# EAGLE schematic base_station (EAGLE 6.6.0)
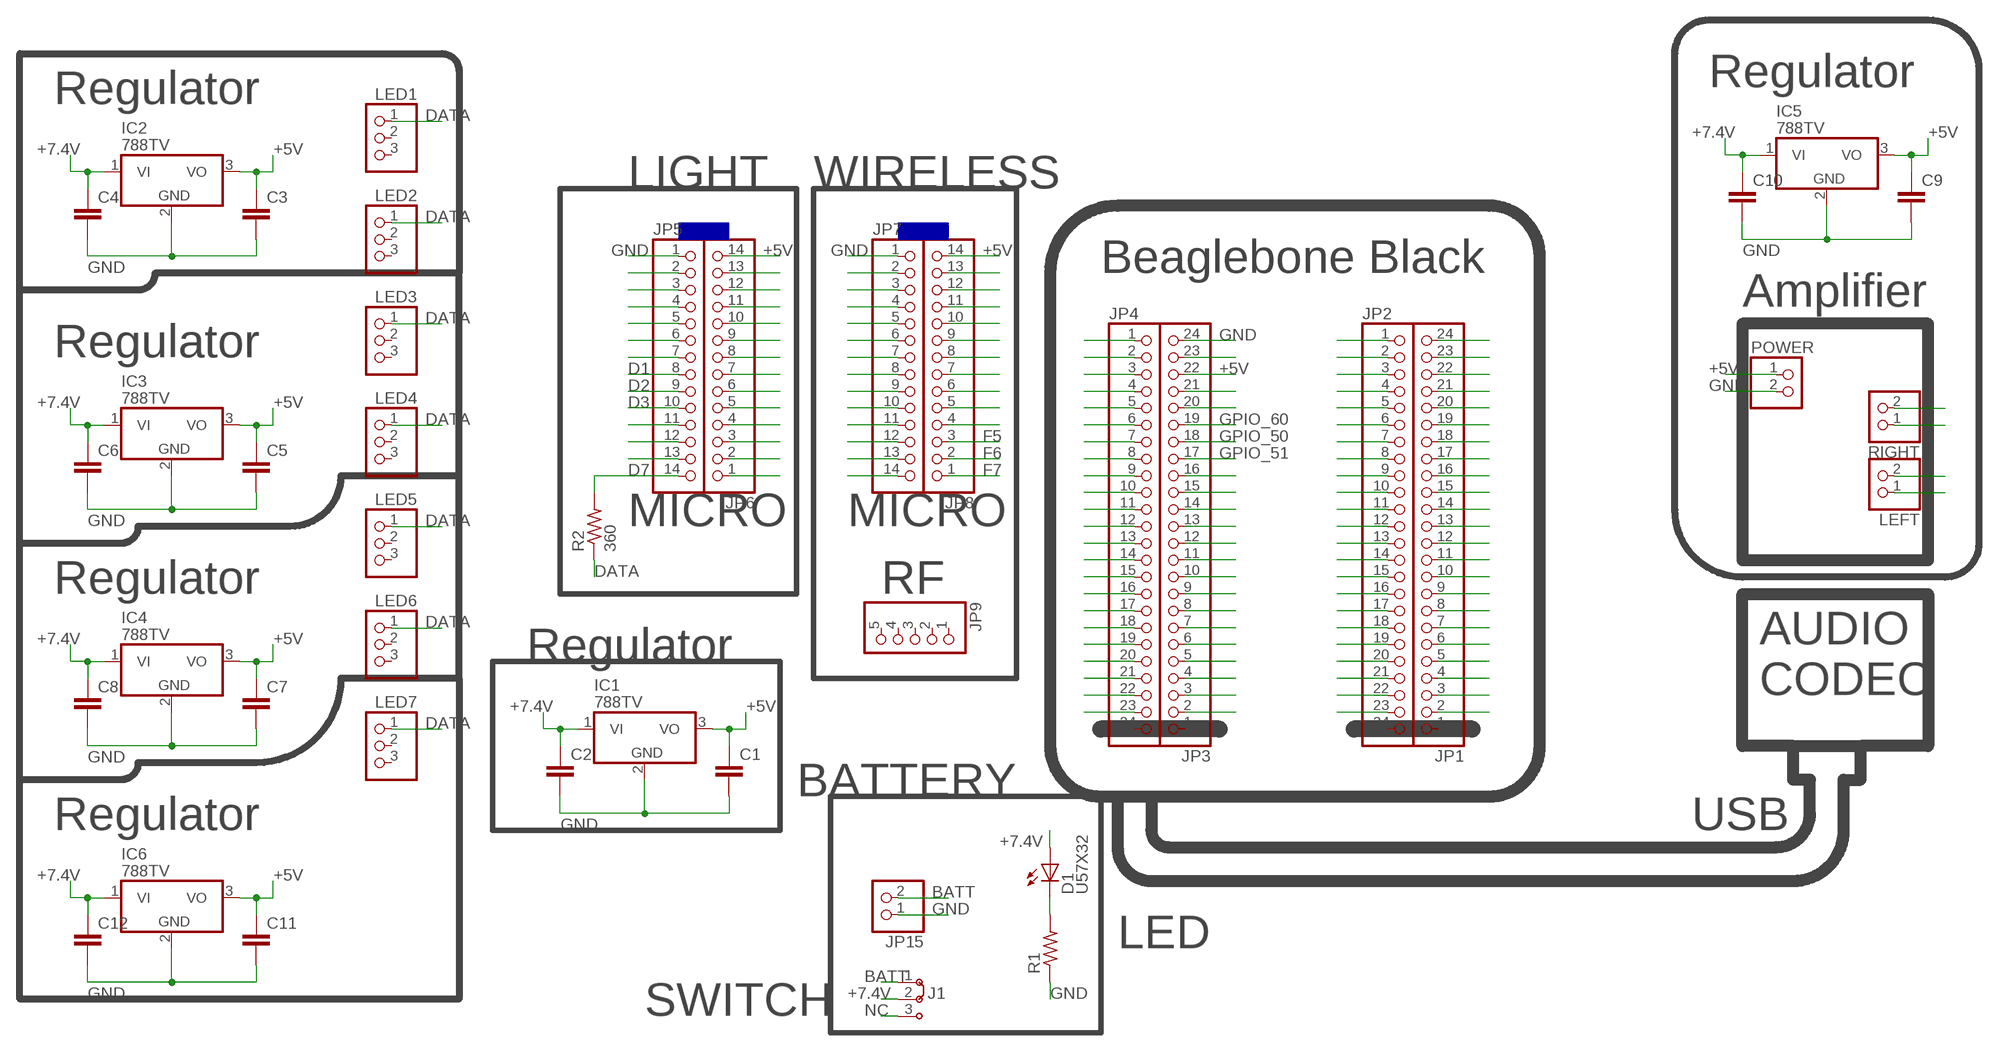
[diagram p0: schematic, sheet 1]

## Parts
C1  C2,5-3  [C2.5-3]
C2  C2,5-3  [C2.5-3]
C3  C2,5-3  [C2.5-3]
C4  C2,5-3  [C2.5-3]
C5  C2,5-3  [C2.5-3]
C6  C2,5-3  [C2.5-3]
C7  C2,5-3  [C2.5-3]
C8  C2,5-3  [C2.5-3]
C9  C2,5-3  [C2.5-3]
C10  C2,5-3  [C2.5-3]
C11  C2,5-3  [C2.5-3]
C12  C2,5-3  [C2.5-3]
D1  U57X32  [U57X32]
IC1  788TV  [TO220V]
IC2  788TV  [TO220V]
IC3  788TV  [TO220V]
IC4  788TV  [TO220V]
IC5  788TV  [TO220V]
IC6  788TV  [TO220V]
J1  J2X2MM  [04C]
JP1  PINHD-1X24  [1X24]
JP2  PINHD-1X24  [1X24]
JP3  PINHD-1X24  [1X24]
JP4  PINHD-1X24  [1X24]
JP5  PINHD-1X14  [1X14]
JP6  PINHD-1X14  [1X14]
JP7  PINHD-1X14  [1X14]
JP8  PINHD-1X14  [1X14]
JP9  PINHD-1X5  [1X05]
JP15  PINHD-1X2  [1X02]
LED1  PINHD-1X3  [1X03]
LED2  PINHD-1X3  [1X03]
LED3  PINHD-1X3  [1X03]
LED4  PINHD-1X3  [1X03]
LED5  PINHD-1X3  [1X03]
LED6  PINHD-1X3  [1X03]
LED7  PINHD-1X3  [1X03]
LEFT  PINHD-1X2  [1X02]
POWER  PINHD-1X2  [1X02]
R1  R-US_0204/2V  [0204V]
R2  360  R-US_0204/2V  [0204V]
RIGHT  PINHD-1X2  [1X02]

## Nets
+5V: C1.1 C3.1 C5.1 C7.1 C9.1 C11.1 IC1.3(VO) IC2.3(VO) IC3.3(VO) IC4.3(VO) IC5.3(VO) IC6.3(VO) JP3.22 JP6.14 JP8.14 POWER.1
+7.4V: C2.1 C4.1 C6.1 C8.1 C10.1 C12.1 D1.A IC1.1(VI) IC2.1(VI) IC3.1(VI) IC4.1(VI) IC5.1(VI) IC6.1(VI) J1.2
BATT: J1.1 JP15.2
D0: JP5.7 JP7.7
D1: JP5.8 JP7.8
D2: JP5.9 JP7.9
D3: JP5.10
D7: JP5.14 R2.2
DATA: LED1.1 LED2.1 LED3.1 LED4.1 LED5.1 LED6.1 LED7.1 R2.1
F5: JP8.3
F6: JP8.2
F7: JP8.1
GND: C1.2 C2.2 C3.2 C4.2 C5.2 C6.2 C7.2 C8.2 C9.2 C10.2 C11.2 C12.2 IC1.2(GND) IC2.2(GND) IC3.2(GND) IC4.2(GND) IC5.2(GND) IC6.2(GND) JP3.24 JP5.1 JP7.1 JP15.1 POWER.2 R1.1
GPIO_50: JP3.18
GPIO_51: JP3.17
GPIO_60: JP3.19
N$1: JP2.1
N$2: JP2.2
N$3: JP2.3
N$4: JP2.4
N$5: JP2.5
N$6: JP2.6
N$7: JP2.7
N$8: JP2.8
N$9: JP2.9
N$10: JP2.10
N$11: JP2.11
N$12: JP2.12
N$36: JP5.2
N$48: JP5.3
N$50: JP3.23
N$52: JP3.21
N$53: JP3.20
N$57: JP3.16
N$58: JP3.15
N$59: JP3.14
N$60: JP3.13
N$61: JP3.12
N$62: JP3.11
N$63: JP3.10
N$64: JP3.9
N$65: JP3.8
N$66: JP3.7
N$67: JP3.6
N$68: JP3.5
N$69: JP3.4
N$70: JP3.3
N$71: JP3.2
N$72: JP4.1
N$73: JP4.2
N$74: JP4.3
N$75: JP4.4
N$76: JP4.5
N$77: JP4.6
N$78: JP4.7
N$79: JP4.8
N$80: JP4.9
N$81: JP4.10
N$82: JP4.11
N$83: JP4.12
N$84: JP4.13
N$85: JP4.14
N$86: JP4.15
N$87: JP4.16
N$88: JP4.17
N$89: JP4.18
N$90: JP4.19
N$91: JP4.20
N$92: JP4.21
N$93: JP4.22
N$94: JP4.23
N$95: JP5.4
N$96: JP5.5
N$97: JP5.6
N$99: JP5.11
N$100: JP5.12
N$101: JP5.13
N$103: JP6.13
N$104: JP6.12
N$105: JP6.11
N$106: JP6.10
N$107: JP6.9
N$108: JP6.8
N$109: JP6.7
N$110: JP6.6
N$111: JP6.5
N$112: JP6.4
N$113: JP6.3
N$114: JP6.2
N$115: JP6.1
N$116: JP7.2
N$117: JP7.3
N$118: JP7.4
N$119: JP7.5
N$120: JP7.6
N$121: JP7.10
N$122: JP7.11
N$123: JP7.12
N$124: JP7.13
N$125: JP7.14
N$126: JP8.13
N$127: JP8.12
N$128: JP8.11
N$129: JP8.10
N$130: JP8.9
N$131: JP8.8
N$132: JP8.7
N$133: JP8.6
N$134: JP8.5
N$135: JP8.4
N$139: D1.K(C) R1.2
N$142: RIGHT.2
N$143: RIGHT.1
N$144: LEFT.2
N$145: LEFT.1
NC: J1.3
Unconnected: JP1.1 JP1.2 JP1.3 JP1.4 JP1.5 JP1.6 JP1.7 JP1.8 JP1.9 JP1.10 JP1.11 JP1.12 JP1.13 JP1.14 JP1.15 JP1.16 JP1.17 JP1.18 JP1.19 JP1.20 JP1.21 JP1.22 JP1.23 JP1.24 JP2.13 JP2.14 JP2.15 JP2.16 JP2.17 JP2.18 JP2.19 JP2.20 JP2.21 JP2.22 JP2.23 JP2.24 JP3.1 JP4.24 JP9.1 JP9.2 JP9.3 JP9.4 JP9.5 LED1.2 LED1.3 LED2.2 LED2.3 LED3.2 LED3.3 LED4.2 LED4.3 LED5.2 LED5.3 LED6.2 LED6.3 LED7.2 LED7.3

## Notes on the sheet
- Regulator
- Regulator
- LIGHT | WIRELESS
- Beaglebone Black
- Amplifier
- Regulator
- MICRO | MICRO
- Regulator | RF
- AUDIO
- Regulator
- CODEC
- BATTERY
- Regulator | USB
- LED
- SWITCH

## Library data of the parts
C1-C12 = capacitor-wima:C: CAPACITOR naming: grid - package width
D1 = led:U57X32: LED rectangle, 5.7 x 3.2 mm
IC1-IC6 = linear:78*: Positive VOLTAGE REGULATOR Source: http://cache.national.com/ds/LM/LM78L05.pdf http://www.fairchildsemi.com/ds/LM/LM7805.pdf
J1 = jumper:J2: Jumper switch 2 x 2.5 mm
JP1-JP4 = pinhead:PINHD-1X24: PIN HEADER
JP5-JP8 = pinhead:PINHD-1X14: PIN HEADER
JP9 = pinhead:PINHD-1X5: PIN HEADER
JP15 LEFT POWER RIGHT = pinhead:PINHD-1X2: PIN HEADER
LED1-LED7 = pinhead:PINHD-1X3: PIN HEADER
R1 R2 = resistor:R-US_: RESISTOR, American symbol